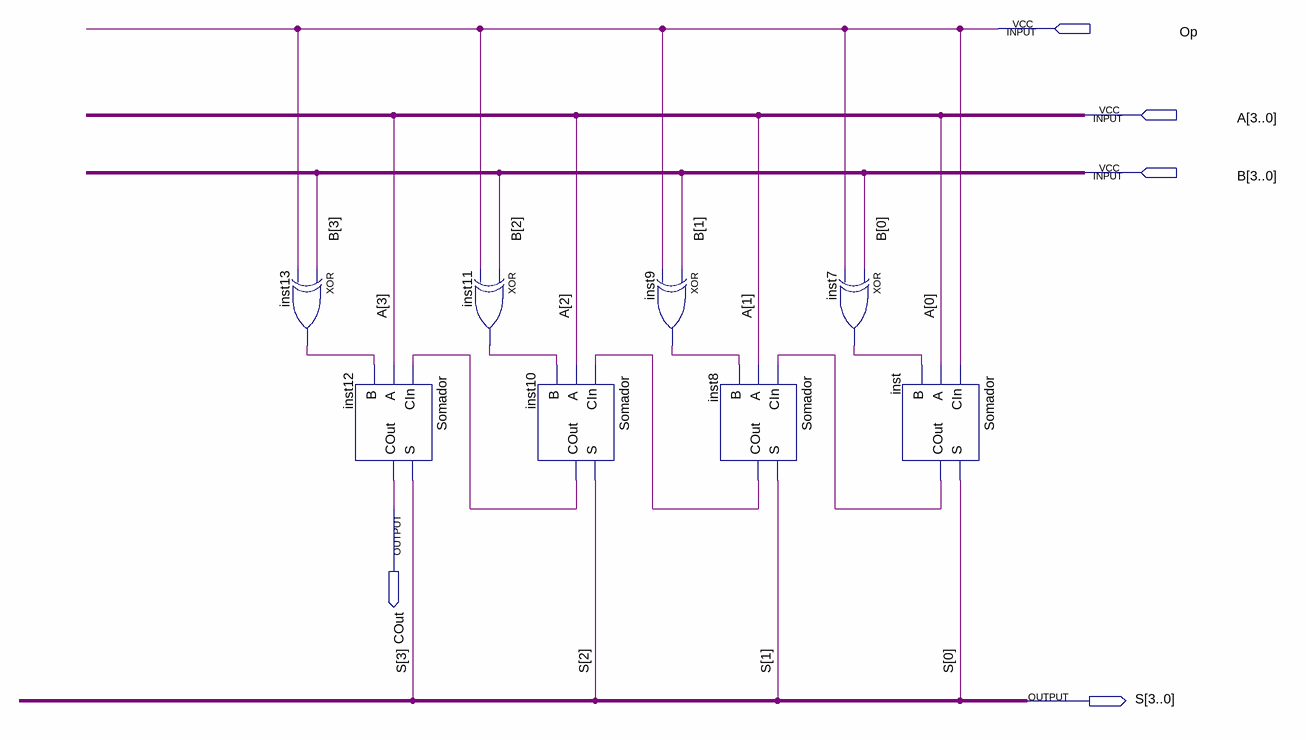
[diagram p0: schematic sheet]
// Quartus schematic Somador_e_Subtrator.bdf as structural Verilog: 8 symbols, 5 pins
module Somador_e_Subtrator (
  input  Op,
  input  [3:0] A,
  input  [3:0] B,
  output COut,
  output [3:0] S
);

  wire inst7_out, inst8_cout, inst9_out, inst10_cout, inst11_out, inst13_out, inst_cout;

  xor inst13 (inst13_out, B[3], Op);
  Somador inst12 (.CIn(inst10_cout), .A(A[3]), .B(inst13_out), .S(S[3]), .COut(COut));
  xor inst11 (inst11_out, B[2], Op);
  Somador inst10 (.CIn(inst8_cout), .A(A[2]), .B(inst11_out), .S(S[2]), .COut(inst10_cout));
  xor inst9 (inst9_out, B[1], Op);
  Somador inst8 (.CIn(inst_cout), .A(A[1]), .B(inst9_out), .S(S[1]), .COut(inst8_cout));
  xor inst7 (inst7_out, B[0], Op);
  Somador inst (.CIn(Op), .A(A[0]), .B(inst7_out), .S(S[0]), .COut(inst_cout));
endmodule
